# EAGLE design Micromouse v4 (EAGLE 9.6.2)
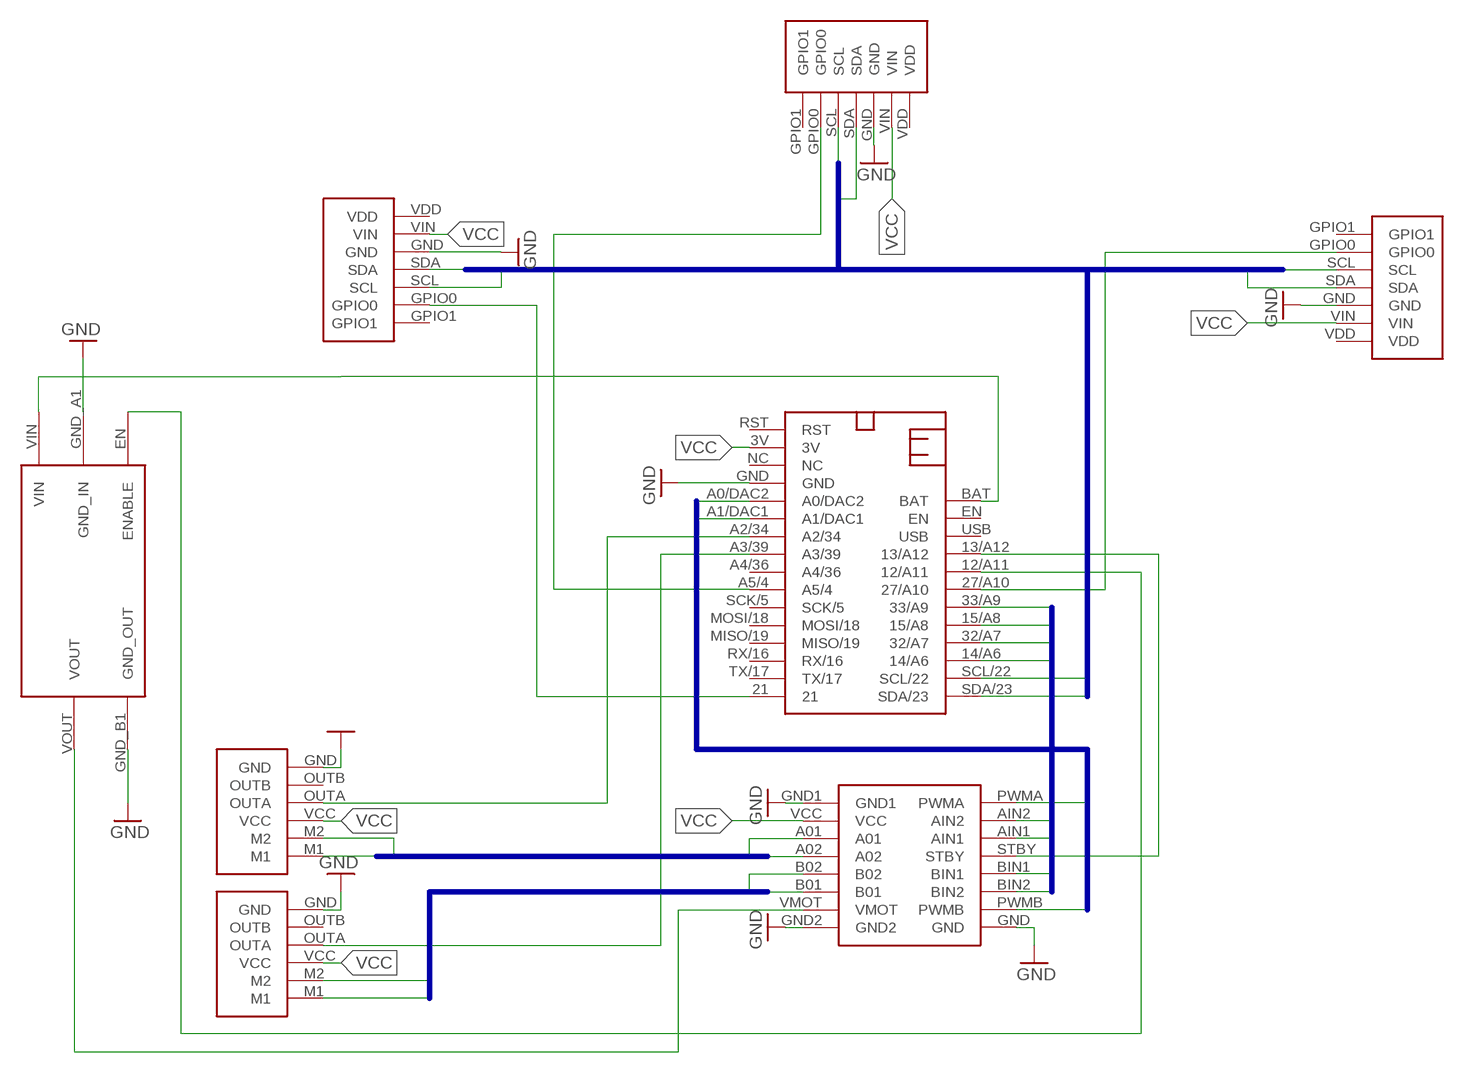
[diagram p0: schematic, sheet 1]

## Parts
12V_BOOST  U3V70F12  [U3V70F12]
ENCODE_A2  ENCODE  [ENCODE]
ENCODE_A3  ENCODE  [ENCODE]
ESP1  ESP32  [ESP32]
MOTOR1  MOTOR  [MOTOR]
VL_21  VL6180-X  [VL6180-X]
VL_27  VL6180-X  [VL6180-X]
VL_A5  VL6180-X  [VL6180-X]

## Nets
AIN1: ESP1.33/A9 MOTOR1.AIN1
AIN2: ESP1.15/A8 MOTOR1.AIN2
BIN1: ESP1.32/A7 MOTOR1.BIN1
BIN2: ESP1.14/A6 MOTOR1.BIN2
BOOST_IN [12V]: 12V_BOOST.VIN ESP1.BAT
BOOST_OUT [12V]: 12V_BOOST.VOUT MOTOR1.VMOT
GND: 12V_BOOST.GND_A1(GND_IN) 12V_BOOST.GND_B1(GND_OUT) ENCODE_A2.GND ENCODE_A3.GND ESP1.GND MOTOR1.GND MOTOR1.GND1 MOTOR1.GND2 VL_21.GND VL_27.GND VL_A5.GND
MA1 [12V]: ENCODE_A2.M1 MOTOR1.A01
MA2 [12V]: ENCODE_A2.M2 MOTOR1.A02
MB1 [12V]: ENCODE_A3.M1 MOTOR1.B01
MB2 [12V]: ENCODE_A3.M2 MOTOR1.B02
N$1: 12V_BOOST.EN(ENABLE) ESP1.12/A11
N$11: ESP1.13/A12 MOTOR1.STBY
N$15: ENCODE_A2.OUTA ESP1.A2/34
N$16: ENCODE_A3.OUTA ESP1.A3/39
N$18: ESP1.27/A10 VL_27.GPIO0
N$19: ESP1.21 VL_21.GPIO0
N$20: ESP1.A5/4 VL_A5.GPIO0
PWMA: ESP1.A1/DAC1 MOTOR1.PWMA
PWMB: ESP1.A0/DAC2 MOTOR1.PWMB
SCL: ESP1.SCL/22 VL_21.SCL VL_27.SCL VL_A5.SCL
SDA: ESP1.SDA/23 VL_21.SDA VL_27.SDA VL_A5.SDA
VCC: ENCODE_A2.VCC ENCODE_A3.VCC ESP1.3V MOTOR1.VCC VL_21.VIN VL_27.VIN VL_A5.VIN
Unconnected: ENCODE_A2.OUTB ENCODE_A3.OUTB ESP1.A4/36 ESP1.EN ESP1.MISO/19 ESP1.MOSI/18 ESP1.NC ESP1.RST ESP1.RX/16 ESP1.SCK/5 ESP1.TX/17 ESP1.USB VL_21.GPIO1 VL_21.VDD VL_27.GPIO1 VL_27.VDD VL_A5.GPIO1 VL_A5.VDD

## Buses
I2C:SCL,SDA
MA:MA1,MA2
MB:MB1,MB2
PWM:PWMA,PWMB
MOTOR:AIN[1..2],BIN[1..2]

## Library data of the parts
12V_BOOST = micromouse:U3V70F12
ENCODE_A2 ENCODE_A3 = micromouse:ENCODE
ESP1 = micromouse:ESP32
MOTOR1 = micromouse:MOTOR
VL_21 VL_27 VL_A5 = micromouse:VL6180-X

## Net classes
0 default: width 0.406 mm, drill 0.508 mm, clearance 0.254 mm
1 12V: width 0.61 mm, drill 0.508 mm, clearance 0.406 mm to class 0, clearance 0.406 mm

## Board
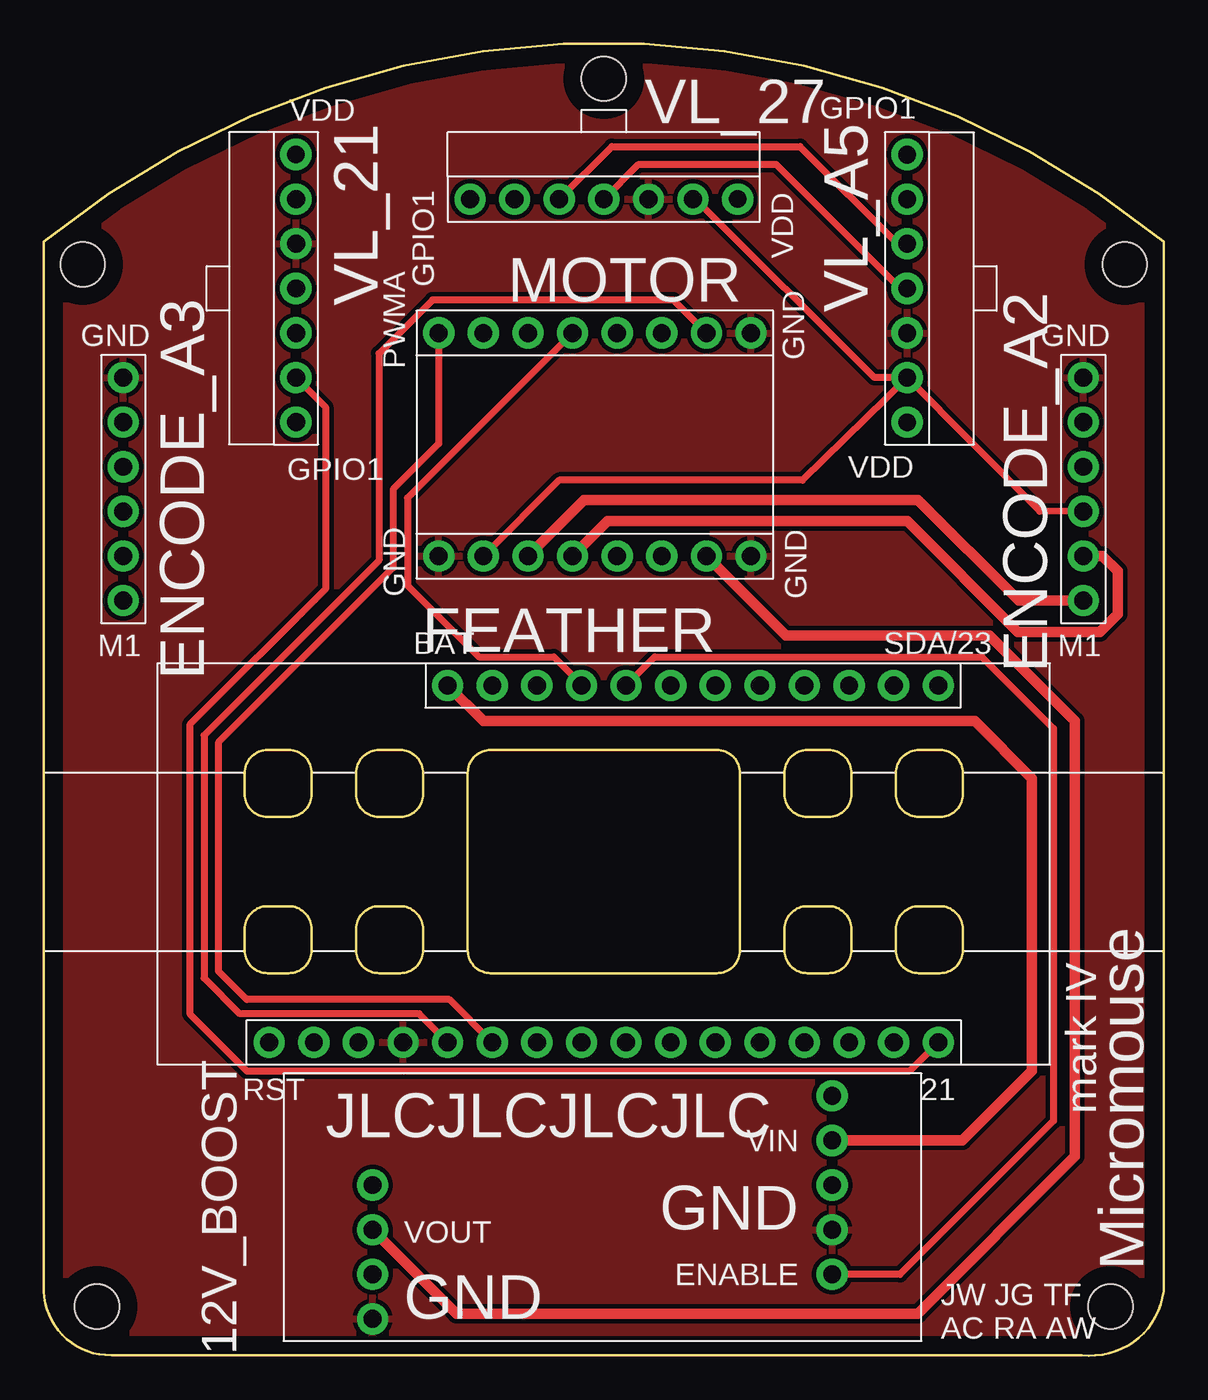
[diagram p1: board, top side]
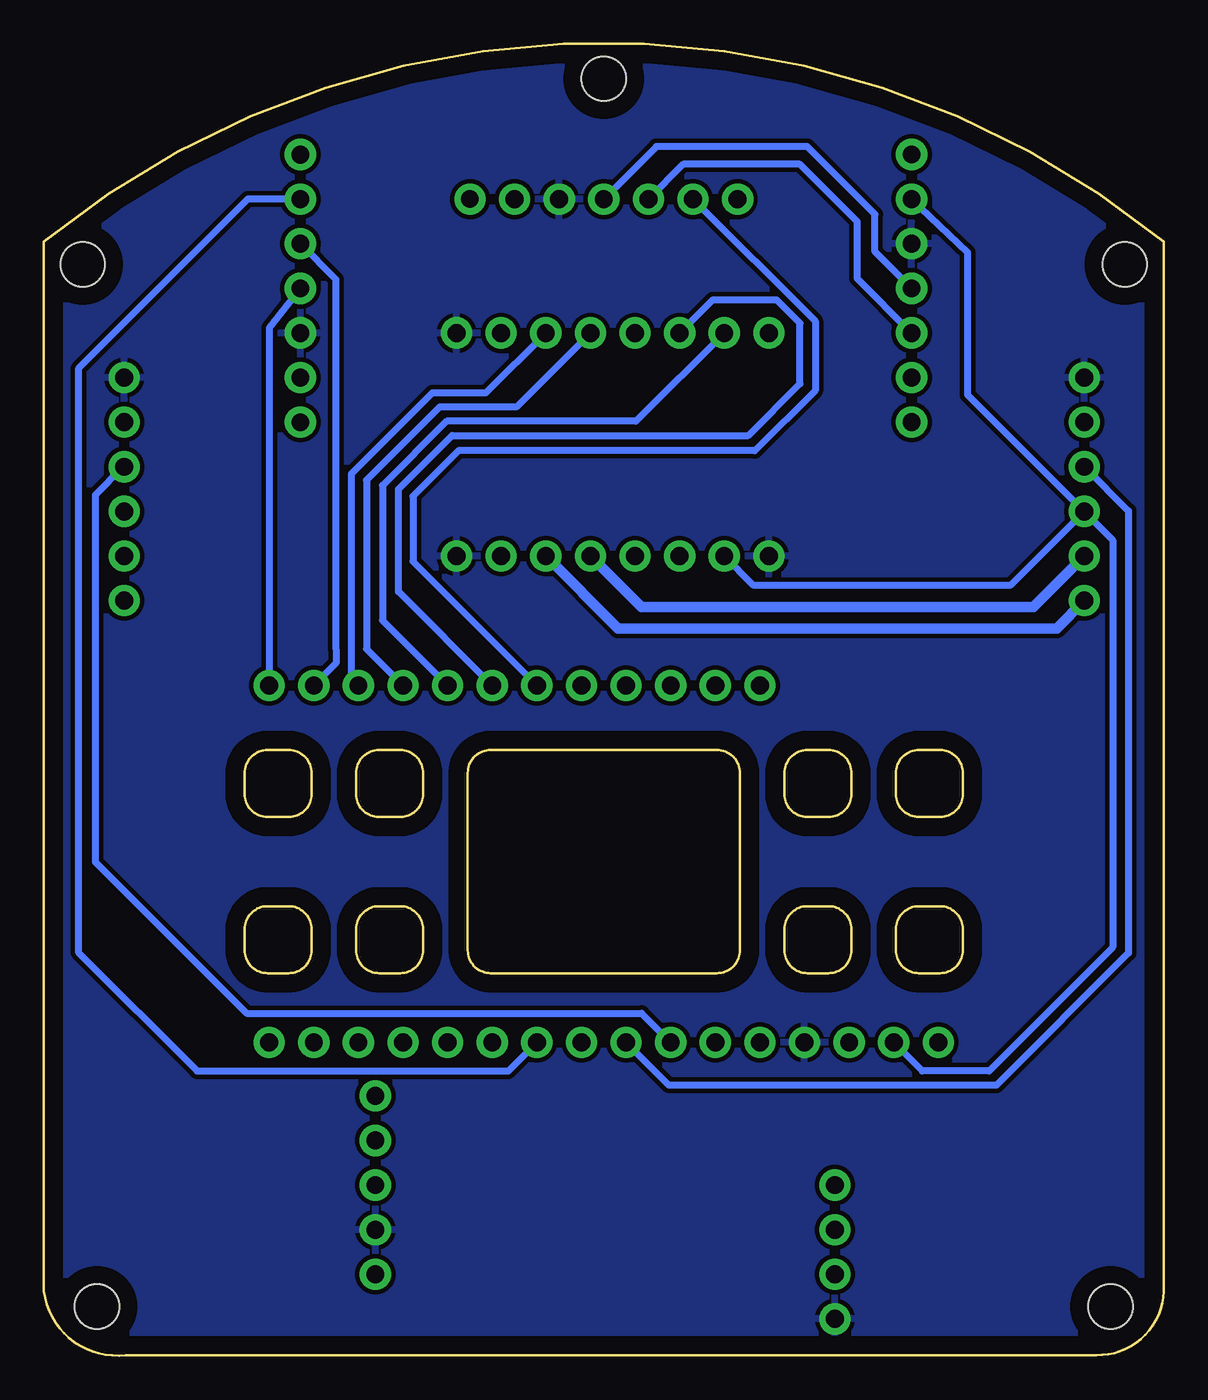
[diagram p2: board, bottom side, seen from below]

Size 63.75 x 74.68 mm. Coordinates in mm from the lower left corner, seen from the top.
Outline: 59.09,0.03 3.85,0.03 arc-90 0,3.67 0,63.43 arc-78 63.75,63.43 63.75,3.67 arc-90 59.09,0.03
Outline: 38.32,34.47 25.43,34.47 arc90 24.13,33.17 24.13,23.07 arc90 25.43,21.77 38.32,21.77 arc90 39.62,23.07 39.62,33.17 arc90 38.32,34.47
Outline: 19.08,34.47 20.29,34.47 arc-90 21.59,33.17 21.59,31.96 arc-90 20.29,30.66 19.08,30.66 arc-90 17.78,31.96 17.78,33.17 arc-90 19.08,34.47
Outline: 13.94,34.47 12.73,34.47 arc90 11.43,33.17 11.43,31.96 arc90 12.73,30.66 13.94,30.66 arc90 15.24,31.96 15.24,33.17 arc90 13.94,34.47
Outline: 11.43,24.28 11.43,23.07 arc90 12.73,21.77 13.94,21.77 arc90 15.24,23.07 15.24,24.28 arc90 13.94,25.58 12.73,25.58 arc90 11.43,24.28
Outline: 19.08,25.58 20.29,25.58 arc-90 21.59,24.28 21.59,23.07 arc-90 20.29,21.77 19.08,21.77 arc-90 17.78,23.07 17.78,24.28 arc-90 19.08,25.58
Outline: 43.46,34.47 44.67,34.47 arc-90 45.97,33.17 45.97,31.96 arc-90 44.67,30.66 43.46,30.66 arc-90 42.16,31.96 42.16,33.17 arc-90 43.46,34.47
Outline: 49.81,34.47 51.02,34.47 arc-90 52.32,33.17 52.32,31.96 arc-90 51.02,30.66 49.81,30.66 arc-90 48.51,31.96 48.51,33.17 arc-90 49.81,34.47
Outline: 43.46,25.58 44.67,25.58 arc-90 45.97,24.28 45.97,23.07 arc-90 44.67,21.77 43.46,21.77 arc-90 42.16,23.07 42.16,24.28 arc-90 43.46,25.58
Outline: 49.81,25.58 51.02,25.58 arc-90 52.32,24.28 52.32,23.07 arc-90 51.02,21.77 49.81,21.77 arc-90 48.51,23.07 48.51,24.28 arc-90 49.81,25.58
Copper layers (1*16): Top 0.035mm / dielectric 1.5mm / Bottom 0.035mm
Design rules "default": minimum track width 6mil, minimum drill 0.35mm, track to track 6mil, track to pad 6mil, pad to pad 6mil, via to via 6mil, smd to smd 6mil, copper to edge 40mil, drill to drill 6mil, minimum pad ring 10mil, minimum via ring 8mil, stop-mask expansion 4mil, vias tented up to drill 0mil, thermal gap 10mil
Holes 2.54 mm at 31.88,72.7 61.54,62.13 2.21,62.13 60.73,2.8 3.02,2.8

### Footprints (pad centres in the part's own frame; a part is rotated, then mirrored left to right if it is on the bottom)
U3V70F12 = drill 1.016 pad 1.778: EN -11.43,3.81; GND_A1 -11.43,1.27; GND_A2 -11.43,-1.27; GND_B1 14.732,6.35; GND_B2 14.732,3.81; P$1 14.732,-1.27; P$2 -11.43,-6.35; VIN -11.43,-3.81; VOUT 14.732,1.27
ENCODE = drill 1.016 pad 1.778: GND 1.27,1.27; M1 1.27,13.97; M2 1.27,11.43; OUTA 1.27,6.35; OUTB 1.27,3.81; VCC 1.27,8.89
ESP32 = drill 1.016 pad 1.778: 3V 1.27,41.91; 12/A11 21.59,24.13; 13/A12 21.59,26.67; 14/A6 21.59,11.43; 15/A8 21.59,16.51; 21 1.27,6.35; 27/A10 21.59,21.59; 32/A7 21.59,13.97; 33/A9 21.59,19.05; A0/DAC2 1.27,34.29; A1/DAC1 1.27,31.75; A2/34 1.27,29.21; A3/39 1.27,26.67; A4/36 1.27,24.13; A5/4 1.27,21.59; BAT 21.59,34.29; EN 21.59,31.75; GND 1.27,36.83; MISO/19 1.27,13.97; MOSI/18 1.27,16.51; NC 1.27,39.37; RST 1.27,44.45; RX/16 1.27,11.43; SCK/5 1.27,19.05; SCL/22 21.59,8.89; SDA/23 21.59,6.35; TX/17 1.27,8.89; USB 21.59,29.21
MOTOR = drill 1.016 pad 1.778: A01 1.27,13.97; A02 1.27,11.43; AIN1 13.97,13.97; AIN2 13.97,16.51; B01 1.27,6.35; B02 1.27,8.89; BIN1 13.97,8.89; BIN2 13.97,6.35; GND 13.97,1.27; GND1 1.27,19.05; GND2 1.27,1.27; PWMA 13.97,19.05; PWMB 13.97,3.81; STBY 13.97,11.43; VCC 1.27,16.51; VMOT 1.27,3.81
VL6180-X = drill 1.016 pad 1.778: GND 1.27,3.81; GPIO0 1.27,11.43; GPIO1 1.27,13.97; SCL 1.27,8.89; SDA 1.27,6.35; VIN 1.27,1.27 | drill 1 pad 1.778: VDD 1.27,-1.27

### Placement (x,y rotation side)
12V_BOOST  33.45,8.44 180 top
ENCODE_A2  60.45,56.95 180 top
ENCODE_A3  5.79,56.95 180 top
ESP1  57.28,16.56 90 top
MOTOR1  41.53,44.25 90 top
VL_21  15.62,67.11 180 top
VL_27  38.23,64.57 90 top
VL_A5  47.88,54.41 0 top

### Tracks (layer width: path | path; a pad name or v marks a point on that pad's centre or on a via)
AIN1
  Bottom 0.406: ESP1.33/A9 43.56,43.49 43.56,49.33 40.51,52.38 23.65,52.38 20.7,55.32 20.7,58.78 22.02,60.1 25.68,60.1 MOTOR1.AIN1
AIN2
  Bottom 0.406: MOTOR1.AIN2 30.05,53.19 40.82,53.19 44.48,49.53 44.48,41.86 ESP1.15/A8
BIN1
  Bottom 0.406: MOTOR1.BIN1 36.85,54 41.22,54 45.39,49.84 45.39,40.24 ESP1.32/A7
BIN2
  Bottom 0.406: ESP1.14/A6 46.25,38.56 46.25,50.19 41.63,54.82 38.58,54.82 MOTOR1.BIN2
BOOST_IN
  Top 0.61: ESP1.BAT 25.02,36.12 53.01,36.12 56.26,32.87 56.26,16.21 52.3,12.25 12V_BOOST.VIN
BOOST_OUT
  Top 0.61: 12V_BOOST.VOUT 23.49,2.39 49.76,2.39 58.7,11.33 58.7,36.12 53.82,41 42.24,41 MOTOR1.VMOT
GND
  pour Top: -1.65,74.73 -1.65,-2.74 60.58,-2.74 65.66,-2.74 65.66,39.17 65.66,76 2.16,76 -1.65,76
  pour Bottom: -2.92,77.27 -2.92,-4.01 54.23,-4.01 66.93,-4.01 66.93,68.38 66.93,77.27
MA1
  Top 0.61: MOTOR1.A01 30.76,48.72 49.76,48.72 55.5,42.98 ENCODE_A2.M1
MA2
  Top 0.61: MOTOR1.A02 32.08,47.5 49.15,47.5 55.45,41.2 60.12,41.2 61.14,42.22 61.14,44.66 60.27,45.52 ENCODE_A2.M2
MB1
  Bottom 0.61: ENCODE_A3.M1 6.1,41.41 31.06,41.41 MOTOR1.B01
MB2
  Bottom 0.61: ENCODE_A3.M2 7.42,42.62 29.74,42.62 MOTOR1.B02
N$1
  Top 0.406: ESP1.12/A11 34.77,39.78 53.42,39.78 57.48,35.72 57.48,13.36 48.74,4.63 12V_BOOST.EN
N$11
  Top 0.406: MOTOR1.STBY 20.7,48.82 20.7,43.84 24.77,39.78 29.03,39.78 30.61,38.21 ESP1.13/A12
N$15
  Bottom 0.406: ESP1.A2/34 29.72,19.49 52.22,19.49 60.83,28.1 60.83,49 59.23,50.6 ENCODE_A2.OUTA
N$16
  Bottom 0.406: ENCODE_A3.OUTA 2.01,48.09 2.01,22.91 9.53,15.4 28.17,15.4 ESP1.A3/39
N$18
  Bottom 0.406: VL_27.GPIO0 19.84,58.88 19.84,54.95 23.27,51.51 40.16,51.51 42.75,48.92 42.75,45.22 ESP1.27/A10
N$19
  Top 0.406: VL_21.GPIO0 16.03,54 16.03,43.64 8.31,35.92 8.31,19.46 11.56,16.21 49.3,16.21 ESP1.21
N$20
  Bottom 0.406: ESP1.A5/4 37.31,16.21 55.04,16.21 61.8,22.97 61.8,56.19 52.15,65.84 VL_A5.GPIO0
PWMA
  Top 0.406: MOTOR1.PWMA 22.48,51.92 19.89,49.33 19.89,44.86 9.93,34.9 9.93,24.34 9.93,21.9 11.56,20.27 23.09,20.27 ESP1.A1/DAC1
PWMB
  Top 0.406: MOTOR1.PWMB 35.84,60.1 22.12,60.1 19.08,57.05 19.08,45.27 9.12,35.31 9.12,21.49 11.15,19.46 21.36,19.46 ESP1.A0/DAC2
SCL
  Top 0.406: VL_27.SCL 32.33,68.84 43.05,68.84 48.59,63.3 VL_A5.SCL
  Bottom 0.406: ESP1.SCL/22 47.12,39.42 47.12,40.24 47.12,61.27 VL_A5.SCL | VL_27.SCL 27.36,67.82 20.7,67.82 17.45,64.57 17.45,61.32 VL_21.SCL
SDA
  Top 0.406: VL_27.SDA 33.86,67.82 41.68,67.82 48.74,60.76 VL_A5.SDA
  Bottom 0.406: VL_A5.SDA 50.93,58.51 ESP1.SDA/23 | VL_21.SDA 16.43,62.84 16.43,64.98 20.3,68.84 28.88,68.84 VL_27.SDA
VCC
  Top 0.406: VL_A5.VIN 47.28,55.68 37.11,65.84 VL_27.VIN | ENCODE_A2.VCC 56.69,48.08 VL_A5.VIN | MOTOR1.VCC 29.34,49.84 43.2,49.84 VL_A5.VIN
  Bottom 0.406: ENCODE_A3.VCC 11.15,54.69 11.15,62.8 VL_21.VIN | ENCODE_A3.VCC 8.74,43.84 23.34,43.84 MOTOR1.VCC | ESP1.3V 13.74,16.21 9.93,16.21 2.9,23.24 2.9,46.43 ENCODE_A3.VCC

### Text on the board
tPlace: mark IV
tNames: JLCJLCJLCJLC | Micromouse | JW JG TF / AC RA AW